# Altium project Ultrasonic Follow Carrier Receiver PCB.PrjPcb
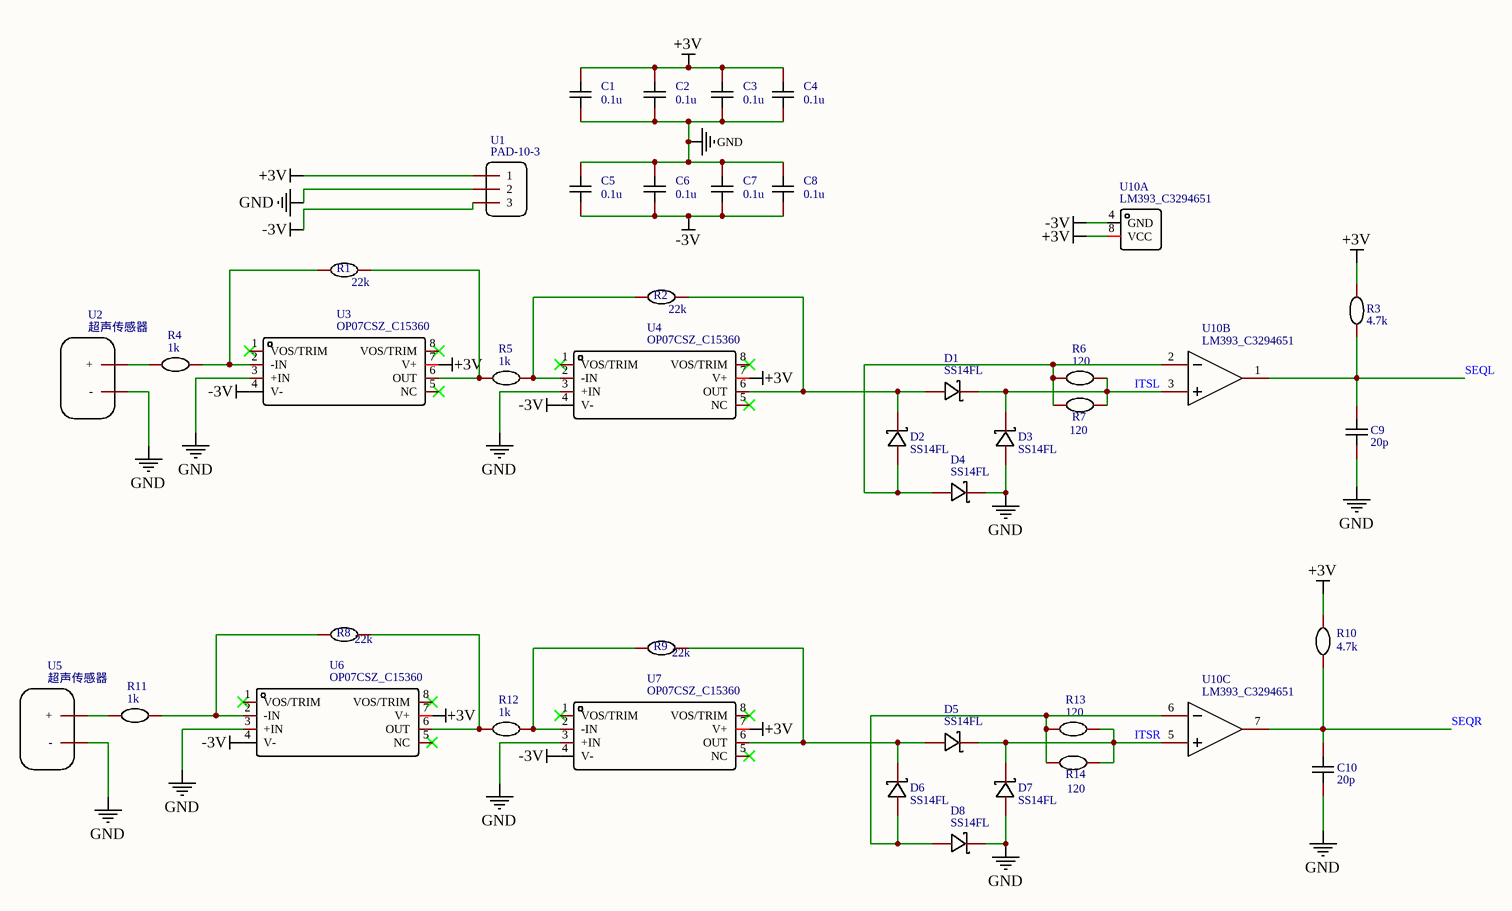
[diagram p0: 1_RX_Ultrasonic.schdoc]
2 sheets, 54 parts. Net scope: global (net labels, ports and power ports of the same name join across sheets).
Board file: PCB_Ultrasonic_rx.pcbdoc
Sheets:
  1_RX_Ultrasonic.schdoc
  2_RX_Control.schdoc

## Sheet 1_RX_Ultrasonic.schdoc
size 497 x 243 mm; SheetNumber: 1; SheetTotal: 2

### Parts
C1  0.1u  [C0603]
C2  0.1u  [C0603]
C3  0.1u  [C0603]
C4  0.1u  [C0603]
C5  0.1u  [C0603]
C6  0.1u  [C0603]
C7  0.1u  [C0603]
C8  0.1u  [C0603]
C9  20p  [C0603]
C10  20p  [C0603]
D1  SS14FL  [SMA_L4.4-W2.8-LS5.4-RD]
D2  SS14FL  [SMA_L4.4-W2.8-LS5.4-RD]
D3  SS14FL  [SMA_L4.4-W2.8-LS5.4-RD]
D4  SS14FL  [SMA_L4.4-W2.8-LS5.4-RD]
D5  SS14FL  [SMA_L4.4-W2.8-LS5.4-RD]
D6  SS14FL  [SMA_L4.4-W2.8-LS5.4-RD]
D7  SS14FL  [SMA_L4.4-W2.8-LS5.4-RD]
D8  SS14FL  [SMA_L4.4-W2.8-LS5.4-RD]
R1  22k  [R0603]
R2  22k  [R0603]
R3  4.7k  [R0603]
R4  1k  [R0603]
R5  1k  [R0603]
R6  120  [R0603]
R7  120  [R0603]
R8  22k  [R0603]
R9  22k  [R0603]
R10  4.7k  [R0603]
R11  1k  [R0603]
R12  1k  [R0603]
R13  120  [R0603]
R14  120  [R0603]
U1  PAD-10-3  [PAD-10-3]
U2  超声传感器  [超声传感器]
U3  Name: OP07CSZ_C15360  [SOIC-8_L4.9-W3.9-P1.27-LS6.0-BL]  (hidden comment: OP07CSZ)
U4  Name: OP07CSZ_C15360  [SOIC-8_L4.9-W3.9-P1.27-LS6.0-BL]  (hidden comment: OP07CSZ)
U5  超声传感器  [超声传感器]
U6  Name: OP07CSZ_C15360  [SOIC-8_L4.9-W3.9-P1.27-LS6.0-BL]  (hidden comment: OP07CSZ)
U7  Name: OP07CSZ_C15360  [SOIC-8_L4.9-W3.9-P1.27-LS6.0-BL]  (hidden comment: OP07CSZ)
U10  Name: LM393_C3294651  [SOP-8_L5.0-W4.0-P1.27-LS6.0-BL]  (hidden comment: LM393)  (parts A,B,C of 3)

### Nets
+3V: C1.1 C2.1 C3.1 C4.1 R3.1 R10.1 U1.1 U3.7(V+) U4.7(V+) U6.7(V+) U7.7(V+) U10.8(VCC)
-3V: C5.2 C6.2 C7.2 C8.2 U1.3 U3.4(V-) U4.4(V-) U6.4(V-) U7.4(V-) U10.4(GND)
GND: C1.2 C2.2 C3.2 C4.2 C5.1 C6.1 C7.1 C8.1 C9.1 C10.1 D3.2(A) D4.1(C) D7.2(A) D8.1(C) U1.2 U2.2(-) U3.3(+IN) U4.3(+IN) U5.2(-) U6.3(+IN) U7.3(+IN)
ITSL: D1.1(C) D3.1(C) R6.1 R7.2 U10.3(1IN+)
ITSR: D5.1(C) D7.1(C) R13.2 R14.2 U10.5(2IN+)
SEQL: C9.2 R3.2 U10.1(1OUT)
SEQR: C10.2 R10.2 U10.7(2OUT)
NetD1_2: D1.2(A) D2.1(C) R2.2 U4.6(OUT)
NetD2_2: D2.2(A) D4.2(A) R6.2 R7.1 U10.2(1IN-)
NetD5_2: D5.2(A) D6.1(C) R9.2 U7.6(OUT)
NetD6_2: D6.2(A) D8.2(A) R13.1 R14.1 U10.6(2IN-)
NetR1_1: R1.1 R4.2 U3.2(-IN)
NetR1_2: R1.2 R5.1 U3.6(OUT)
NetR2_1: R2.1 R5.2 U4.2(-IN)
NetR4_1: R4.1 U2.1(+)
NetR8_1: R8.1 R11.2 U6.2(-IN)
NetR8_2: R8.2 R12.1 U6.6(OUT)
NetR9_1: R9.1 R12.2 U7.2(-IN)
NetR11_1: R11.1 U5.1(+)

Not connected (* = marked no-connect by the designer): U3 1(VOS/TRIM)* 5(NC)* 8(VOS/TRIM)*; U4 1(VOS/TRIM)* 5(NC)* 8(VOS/TRIM)*; U6 1(VOS/TRIM)* 5(NC)* 8(VOS/TRIM)*; U7 1(VOS/TRIM)* 5(NC)* 8(VOS/TRIM)*

### Library data of the parts
C1 C5 = 0.1u: Convert to PCB: yes; Name: 0.1u; Symbol: 0.1u; Device: 0.1u; Add into BOM: yes; Origin Footprint: C0603
C2-C4 C6-C8 = 0.1u: Convert to PCB: yes; NAME: 2; Name: 0.1u; Symbol: 0.1u; Device: 0.1u; Add into BOM: yes; Origin Footprint: C0603; NUMBER: 2
C9 C10 = 20p: Convert to PCB: yes; Name: 20p; Symbol: 20p; Device: 20p; Add into BOM: yes; Origin Footprint: C0603
D1-D8 = SS14FL: Manufacturer: SK; Convert to PCB: yes; Name: SS14FL; Symbol: SS14FL; Device: SS14FL; Supplier: LCSC; Manufacturer Part: SS14FL; Supplier Part: C111580; JLCPCB Part Class: Extended Part; Add into BOM: yes; Origin Footprint: SMA_L4.4-W2.8-LS5.4-RD
R1 = 22k: Convert to PCB: yes; NAME: 1; Name: 22k; Symbol: 22k; Device: 22k; Add into BOM: yes; Origin Footprint: R0603; NUMBER: 1
R2 R8 R9 = 22k: Convert to PCB: yes; Name: 22k; Symbol: 22k; Device: 22k; Add into BOM: yes; Origin Footprint: R0603
R3 R10 = 4.7k: Convert to PCB: yes; Name: 4.7k; Symbol: 4.7k; Device: 4.7k; Add into BOM: yes; Origin Footprint: R0603
R4 R11 = 1k: Convert to PCB: yes; Name: 1k; Symbol: 1k; Device: 1k; Add into BOM: yes; Origin Footprint: R0603
R5 R12 = 1k: Convert to PCB: yes; NAME: 1; Name: 1k; Symbol: 1k; Device: 1k; Add into BOM: yes; Origin Footprint: R0603; NUMBER: 1
R6 R7 R13 R14 = 120: Convert to PCB: yes; Name: 120; Symbol: 120; Device: 120; Add into BOM: yes; Origin Footprint: R0603
U1 = PAD-10-3: Convert to PCB: yes; Name: PAD-10-3; Symbol: PAD-10-3; Device: PAD-10-3; Add into BOM: yes; Origin Footprint: PAD-10-3
U2 U5 = 超声传感器: Convert to PCB: yes; Name: 超声传感器; Symbol: 超声传感器; Device: 超声传感器; Add into BOM: yes; Origin Footprint: 超声传感器
U3 U4 U6 U7 = OP07CSZ: Manufacturer: ADI(亚德诺)/LINEAR; Convert to PCB: yes; Symbol: OP07CSZ_C15360; Device: OP07CSZ; Supplier: LCSC; Supplier Part: C15360; Manufacturer Part: OP07CSZ; JLCPCB Part Class: Extended Part; Add into BOM: yes; Origin Footprint: SOIC-8_L4.9-W3.9-P1.27-LS6.0-BL
U10 = LM393: Manufacturer: DOWO(东沃); Convert to PCB: yes; Symbol: LM393_C3294651; Device: LM393; Supplier: LCSC; Supplier Part: C3294651; Manufacturer Part: LM393; link: https://atta.szlcsc.com/upload/public/pdf/source/20220704/E08554B0B0F027380469CE4357F6D587.pdf; Add into BOM: yes; Origin Footprint: SOP-8_L5.0-W4.0-P1.27-LS6.0-BL

## Sheet 2_RX_Control.schdoc
size 497 x 243 mm
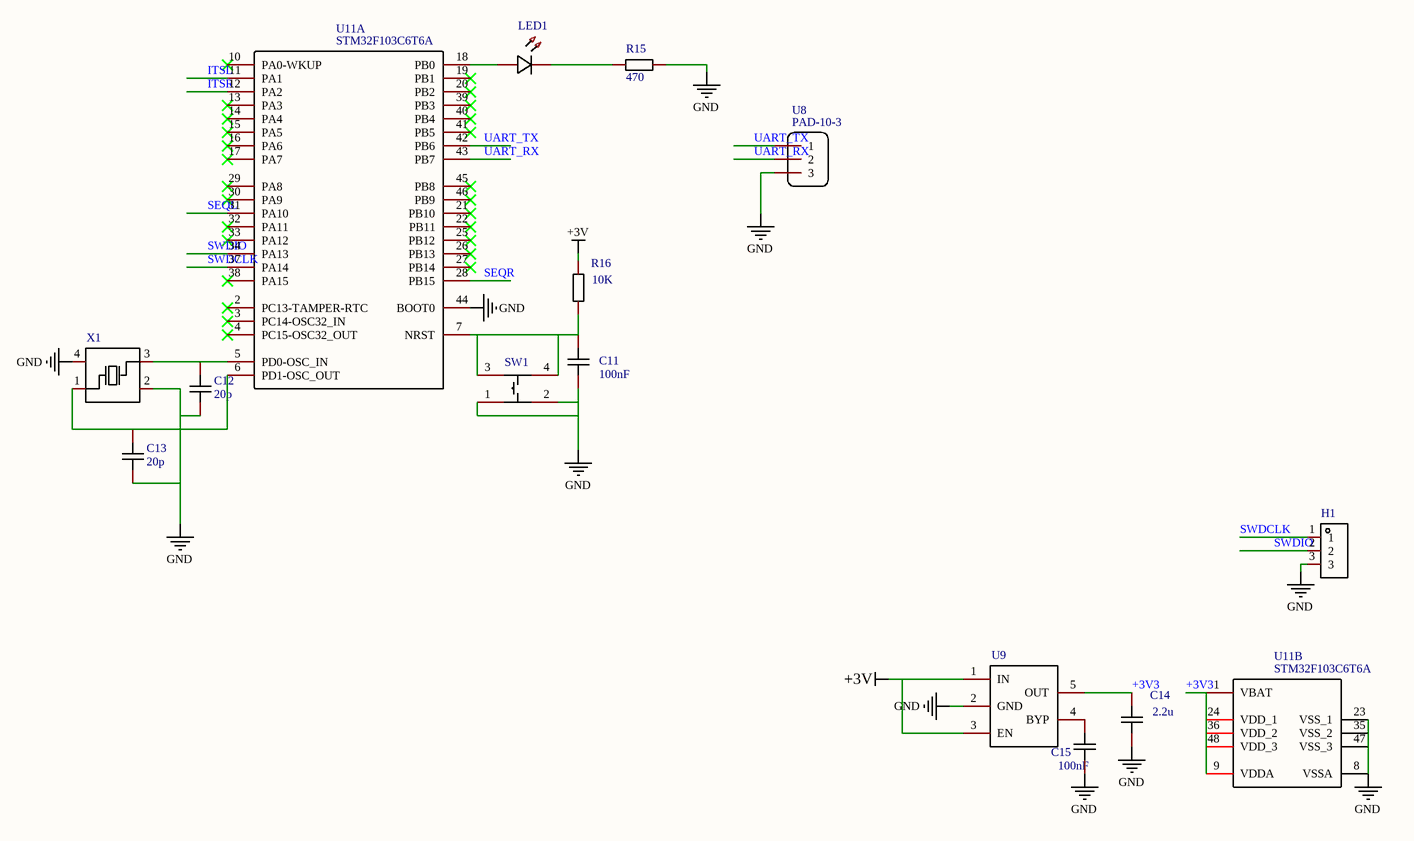
[diagram p1: 2_RX_Control.schdoc]

### Parts
C11  value 100nF  [C0603]  (hidden comment: CAP_0603)
C12  Name: 20p  [C0603]  (hidden comment: CAP_0603)
C13  Name: 20p  [C0603]  (hidden comment: CAP_0603)
C14  value 2.2u  [C0603]  (hidden comment: CAP_0603)
C15  value 100nF  [C0603]  (hidden comment: CAP_0603)
H1  2.54-1*3P正弯针  [HDR-TH_3P-P2.54-H-M-BW7.2-P]  (value not drawn)
LED1  LED_0603-G  [LED0603-RD]  (value not drawn)
R15  value 470  [R0603]  (hidden comment: Res_0603)
R16  value 10K  [R0603]  (hidden comment: Res_0603)
SW1  K2-1809SN-A4DW-06  [KEY-SMD_4P-L3.5-W3.0-P1.50-LS4.6]  (value not drawn)
U8  PAD-10-3  [PAD-10-3]
U9  MIC5205-3.3YM5-TR  [SOT-23-5_L3.0-W1.7-P0.95-LS2.8-TL]  (value not drawn)
U11  STM32F103C6T6A  [LQFP-48_L7.0-W7.0-P0.50-LS9.0-BL]  (parts A,B of 2)
X1  TAXM8M4QLDCDT2T  [OSC-SMD_4P-L5.0-W3.2-BL]  (value not drawn)

### Nets
+3V: R16.2 U9.1(IN) U9.3(EN)
GND: C11.1 C12.1 C13.1 C14.1 C15.1 H1.3 R15.2 SW1.1 SW1.2 U8.3 U9.2(GND) U11.8(VSSA) U11.23(VSS_1) U11.35(VSS_2) U11.44(BOOT0) U11.47(VSS_3) X1.2(GND) X1.4(GND)
+3V3: C14.2 U9.5(OUT) U11.1(VBAT) U11.9(VDDA) U11.24(VDD_1) U11.36(VDD_2) U11.48(VDD_3)
ITSL: U11.11(PA1)
ITSR: U11.12(PA2)
SEQL: U11.31(PA10)
SEQR: U11.28(PB15)
SWDCLK: H1.1 U11.37(PA14)
SWDIO: H1.2 U11.34(PA13)
UART_RX: U8.2 U11.43(PB7)
UART_TX: U8.1 U11.42(PB6)
NetC11_2: C11.2 R16.1 SW1.3 SW1.4 U11.7(NRST)
NetC12_2: C12.2 U11.5(PD0-OSC_IN) X1.3(OSC2)
NetC13_2: C13.2 U11.6(PD1-OSC_OUT) X1.1(OSC1)
NetC15_2: C15.2 U9.4(BYP)
NetLED1_1: LED1.1(C) R15.1
NetLED1_2: LED1.2(A) U11.18(PB0)

Not connected (* = marked no-connect by the designer): U11 2(PC13-TAMPER-RTC)* 3(PC14-OSC32_IN)* 4(PC15-OSC32_OUT)* 10(PA0-WKUP)* 13(PA3)* 14(PA4)* 15(PA5)* 16(PA6)* 17(PA7)* 19(PB1)* 20(PB2)* 21(PB10)* 22(PB11)* 25(PB12)* 26(PB13)* 27(PB14)* 29(PA8)* 30(PA9)* 32(PA11)* 33(PA12)* 38(PA15)* 39(PB3)* 40(PB4)* 41(PB5)* 45(PB8)* 46(PB9)*

### Library data of the parts
C11 C14 C15 = CAP_0603: 容值:100nF;精度:±10%;额定电压:50V;温度系数:X7R;; Symbol: C1210X7R475K630NT; Convert to PCB: yes; Device: CAP_0603; Add into BOM: yes; Supplier Footprint: 0603
C12 C13 = CAP_0603: 容值:100nF;精度:±10%;额定电压:50V;温度系数:X7R;; Symbol: C1210X7R475K630NT; Convert to PCB: yes; Value: 100nF; Device: CAP_0603; Add into BOM: yes; Supplier Footprint: 0603
H1 = 2.54-1*3P正弯针: 间距:2.54mm;总PIN位数:3;排数:1;插针结构:1x3P;行距:-;安装类型:弯插;圆针/方针:方针;额定电流:3A;额定电压:-;配合针长度:3mm;塑高:2.54mm;端接针长度:-;触头材质:-;触头镀层:-;工作温度范围:-55~+105;颜色:黑色;; Manufacturer: BOOMELE(博穆精密); Symbol: C92159; Add into BOM: yes; Pitch: 2.54mm; Pin Structure: 1x3P; Circluar Pins/Square Pins: 方针; Current Rating (Max): 3A; Device: 2.54-1*3P正弯针; LCSC Part Name: 2.54mm 1x3P; Supplier Part: C92159; Manufacturer Part: 2.54-1*3P正弯针; Supplier Footprint: 插件,P=2.54mm; JLCPCB Part Class: Extended Part; Datasheet: https://atta.szlcsc.com/upload/public/pdf/source/20181121/C2334_B051029C4931EB562F9DCCAAD18AC88A.pdf; Supplier: LCSC; Convert to PCB: yes; Number of Pins: 3; Number of Rows: 1; Row Spacing: -; Mounting Type: 弯插; Voltage Rating (Max): -; Length of Mating Pin: 3mm; Insulation Height: 2.54mm; Length of End Connection Pin: -; Contact Material: -; Contact Plating: -; Operating Temperature Range: -55~+105; Color: 黑色
LED1 = LED_0603-G: 照明颜色:翠绿;色温 - CCT（K）:-;主波长/色坐标:520~535nm;; Symbol: LED_G; Convert to PCB: yes; Device: LED_0603-G; Add into BOM: yes; Supplier Footprint: 0603; Supplier Part: C72043
R15 R16 = Res_0603: Symbol: 电阻; Convert to PCB: yes; Device: Res_0603; Add into BOM: yes; Supplier Footprint: 0603
SW1 = K2-1809SN-A4DW-06: 触点电流:50mA;额定电压(DC):12V;绝缘电阻:100MΩ;电路结构:单刀单掷;安装方式:立贴;按钮形状:圆形按钮;带灯:-;作用力:250gf@±30gf;机械寿命:100000;工作温度:-25~+85;开关长度:3.5mm;开关宽度:3mm;开关高度:1.8mm;; Manufacturer: 韩国韩荣; Add into BOM: yes; Contact Current: 50mA; Voltage Rating (DC): 12V; Insulation Resistance: 100MΩ; Circuit: 单刀单掷; Actuator Style: 圆形按钮; Mechanical Life: 100000; Switch Length: 3.5mm; Switch Width: 3mm; Switch Height: 1.8mm; Symbol: K2-1809SN-A4DW-06; Device: K2-1809SN-A4DW-06; LCSC Part Name: K2-1809SN-A4DW-06; Supplier Part: C223823; Manufacturer Part: K2-1809SN-A4DW-06; Supplier Footprint: SMD; JLCPCB Part Class: Extended Part; Datasheet: https://atta.szlcsc.com/upload/public/pdf/source/20180622/C223823_5E61BEAD00667DA976D15EE542974EF8.pdf; Supplier: LCSC; Convert to PCB: yes; Mounting Style: 立贴; With Lamp: -; Operating Force: 250gf@±30gf; Operating Temperature: -25~+85
U8 = PAD-10-3: Convert to PCB: yes; NUMBER: 3; Name: PAD-10-3; Symbol: PAD-10-3; Device: PAD-10-3; Add into BOM: yes; Origin Footprint: PAD-10-3
U9 = MIC5205-3.3YM5-TR: 输出类型:固定;输出极性:正;输出通道数:1;最大输入电压:16V;输出电压:3.3V;压差:350mV@(150mA);输出电流:150mA;电源纹波抑制比(PRSS):75dB@(100Hz);; Manufacturer: MICROCHIP(美国微芯); Add into BOM: yes; Output Type: 固定; Output Polarity: 正; Number of Outputs: 1; Maximum Input Voltage: 16V; Output Voltage: 3.3V; Symbol: MIC5205-3.3YM5; Device: MIC5205-3.3YM5-TR; LCSC Part Name: Vin=16V Vout=3.3V 150mA 75dB@(100Hz); Supplier Part: C37970; Manufacturer Part: MIC5205-3.3YM5-TR; Supplier Footprint: SOT-23-5; JLCPCB Part Class: Extended Part; Datasheet: https://atta.szlcsc.com/upload/public/pdf/source/20210624/C37970_695848EAF266CFCDDC55149329A6B695.pdf; Supplier: LCSC; Convert to PCB: yes; Dropout Voltage: 350mV@(150mA); Output Current: 150mA; Power Supply Rejection Ratio (PRSS): 75dB@(100Hz)
U11 = STM32F103C6T6A: Manufacturer: ST; tags: STM32; Convert to PCB: yes; Name: STM32F103C6T6A; Symbol: STM32F103C6T6A; Device: STM32F103C6T6A; Supplier Part: C8303; Supplier: LCSC; Manufacturer Part: STM32F103C6T6A; JLCPCB Part Class: Extended Part; Add into BOM: yes; Origin Footprint: LQFP-48_L7.0-W7.0-P0.50-LS9.0-BL
X1 = TAXM8M4QLDCDT2T: 晶振类型:-;频率:-;频率公差:-;频率稳定度:-;负载电容:-;工作温度:-;; Manufacturer: TAE(雅晶鑫); Symbol: SMD-5032_4P8M20PF20PPM; Add into BOM: yes; Device: TAXM8M4QLDCDT2T; LCSC Part Name: SMD-5032_4P 8M 20pf 20ppm; Supplier Part: C133333; Manufacturer Part: TAXM8M4QLDCDT2T; Supplier Footprint: SMD5032-4P; JLCPCB Part Class: Extended Part; Datasheet: https://atta.szlcsc.com/upload/public/pdf/source/20171014/C133333_15079754961691038230.pdf; Supplier: LCSC; Convert to PCB: yes; Crystal Type: -; Value: -; Frequency Tolerance: -; Frequency Stability: -; Load Capacitance: -; Operating Temperature: -

## Nets that join several sheets
+3V: 1_RX_Ultrasonic (12 pins), 2_RX_Control (R16.2 U9.1 U9.3)
GND: 1_RX_Ultrasonic (21 pins), 2_RX_Control (18 pins)
ITSL: 1_RX_Ultrasonic (5 pins), 2_RX_Control (U11.11)
ITSR: 1_RX_Ultrasonic (5 pins), 2_RX_Control (U11.12)
SEQL: 1_RX_Ultrasonic (C9.2 R3.2 U10.1), 2_RX_Control (U11.31)
SEQR: 1_RX_Ultrasonic (C10.2 R10.2 U10.7), 2_RX_Control (U11.28)